# Altium project mipi_test_brd_t0.PrjPCB
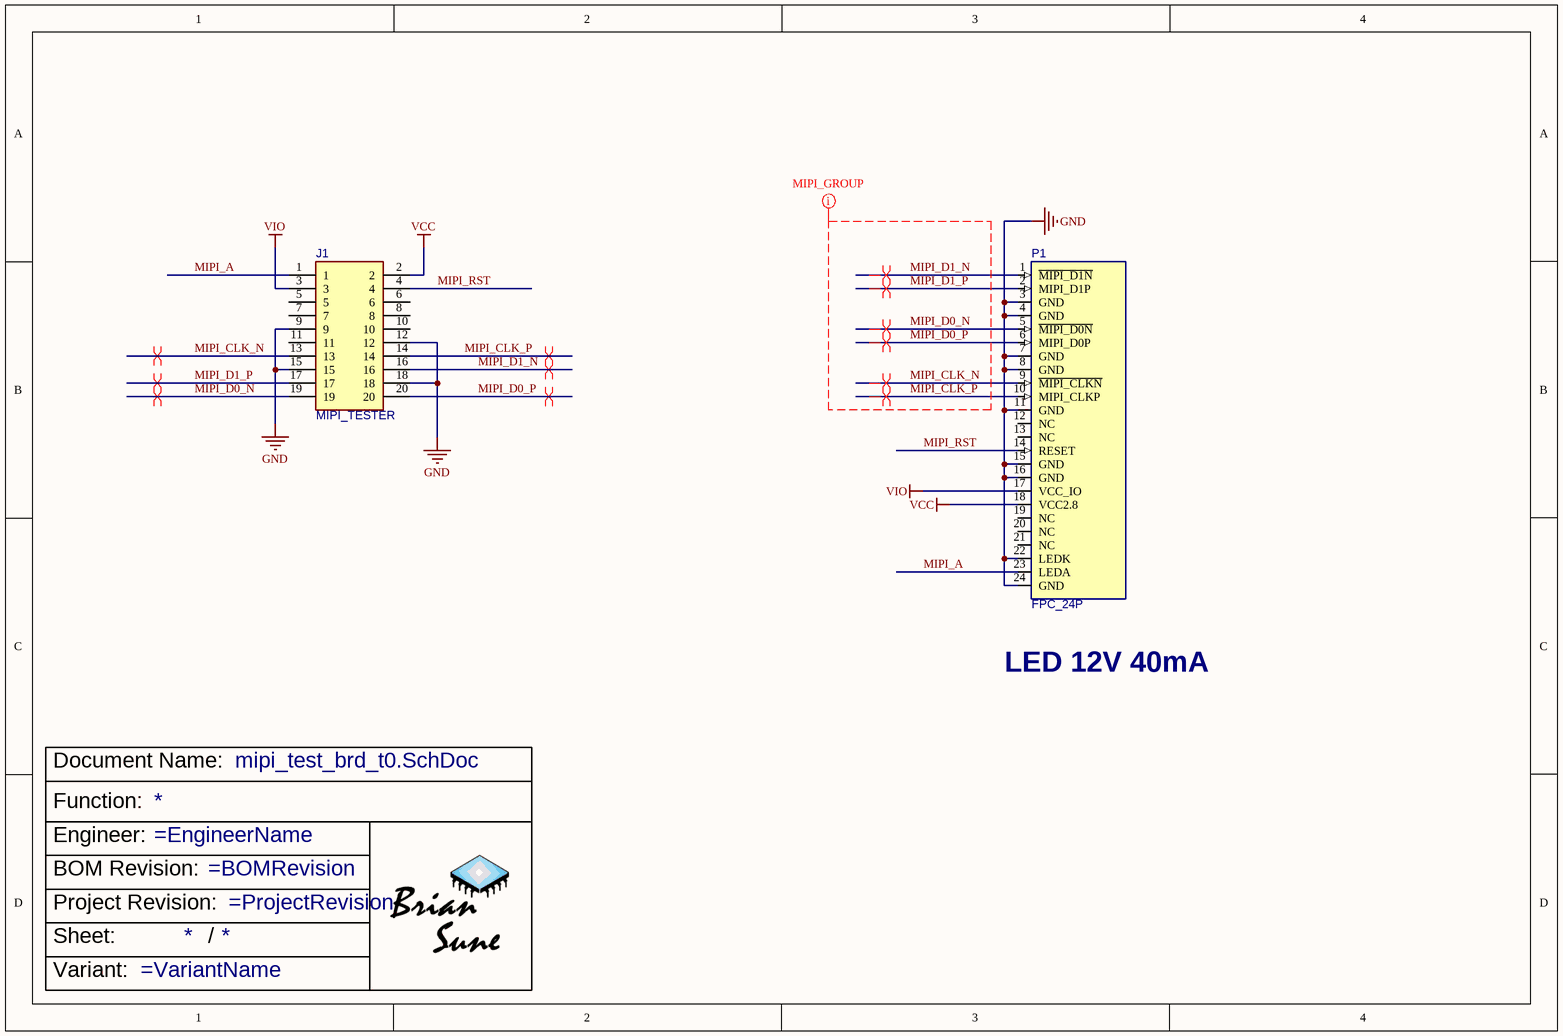
[diagram p0: mipi_test_brd_t0.SchDoc]
1 sheet, 3 parts. Net scope: global (net labels, ports and power ports of the same name join across sheets).
Board file: mipi_test_brd_t0.PcbDoc

## Sheet mipi_test_brd_t0.SchDoc
size A4

### Parts
?  TitleBlock  (value not drawn)  (graphical)
J1  MIPI_TESTER  [20IN]
P1  FPC_24P  [fpc_24p]

### Nets
GND: J1.9 J1.12 J1.15 J1.18 P1.3(GND) P1.4(GND) P1.7(GND) P1.8(GND) P1.11(GND) P1.15(GND) P1.16(GND) P1.22(LEDK) P1.24(GND)
VCC: J1.2 P1.18(VCC2.8)
VIO: J1.3 P1.17(VCC_IO)
MIPI_A: J1.1 P1.23(LEDA)
MIPI_CLK_N: J1.13 P1.9(~{MIPI_CLKN})
MIPI_CLK_P: J1.14 P1.10(MIPI_CLKP)
MIPI_D0_N: J1.19 P1.5(~{MIPI_D0N})
MIPI_D0_P: J1.20 P1.6(MIPI_D0P)
MIPI_D1_N: J1.16 P1.1(~{MIPI_D1N})
MIPI_D1_P: J1.17 P1.2(MIPI_D1P)
MIPI_RST: J1.4 P1.14(RESET)

Not connected (* = marked no-connect by the designer): J1 5 6 7 8 10 11; P1 12(NC) 13(NC) 19(NC) 20(NC) 21(NC)

### Layout directives
differential pair: MIPI_CLK_N, MIPI_CLK_P, MIPI_D0_N, MIPI_D0_P, MIPI_D1_N, MIPI_D1_P
net class MIPI_SIG: MIPI_CLK_N, MIPI_CLK_P, MIPI_D0_N, MIPI_D0_P, MIPI_D1_N, MIPI_D1_P

### Notes on the sheet
- LED 12V 40mA
- (in symbol TitleBlock) Document Name:; Function:; Engineer:; BOM Revision:; Project Revision:; Sheet:; /; Variant:

### Library data of the parts
J1 = 20P_MIPI
P1 = FPC_24P: Mfr.: taobao; Mfr. No: NA; ComponentLink1Description: taobao; ComponentLink1URL: https://detail.tmall.com/item.htm?_u=d10quk0kaff2&id=642914318905&spm=a1z09.2.0.0.56372e8dDu4abt&skuId=4620820056603; Price: 0.33
? = TitleBlock: Function: *